# EAGLE schematic Adafruit NeoTrellis M4 (EAGLE 9.1.3)

## Sheet 1 of 2
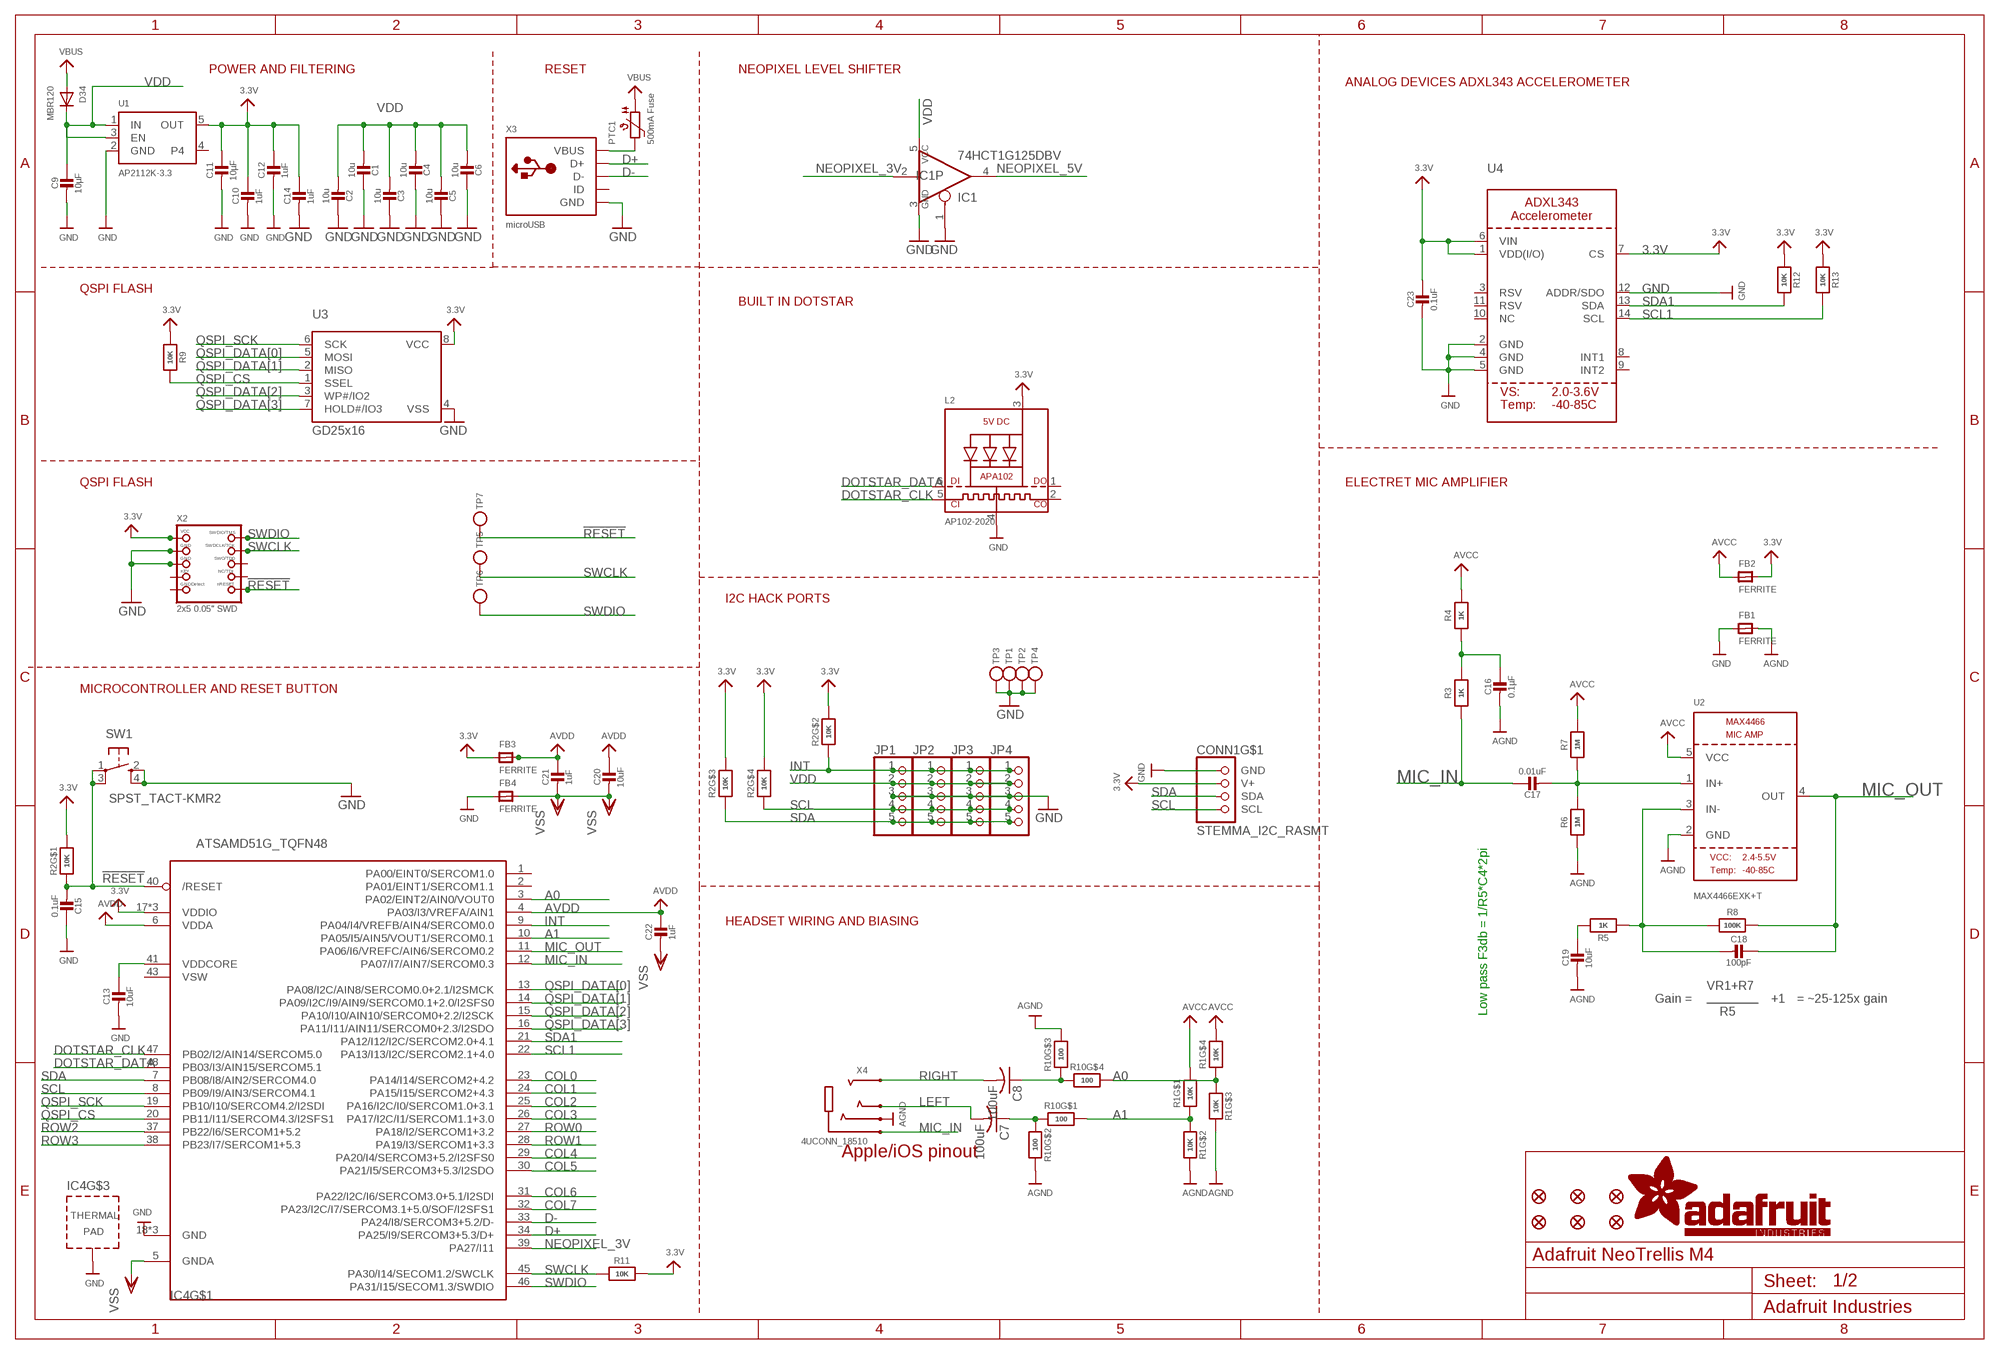
[diagram p0: schematic, sheet 1]

### Parts
C1  10u  CAP_CERAMIC0805-NOOUTLINE  [0805-NO]
C2  10u  CAP_CERAMIC0805-NOOUTLINE  [0805-NO]
C3  10u  CAP_CERAMIC0805-NOOUTLINE  [0805-NO]
C4  10u  CAP_CERAMIC0805-NOOUTLINE  [0805-NO]
C5  10u  CAP_CERAMIC0805-NOOUTLINE  [0805-NO]
C6  10u  CAP_CERAMIC0805-NOOUTLINE  [0805-NO]
C7  100uF  C-USC1210  [C1210]
C8  100uF  C-USC1210  [C1210]
C9  10µF  CAP_CERAMIC0805-NOOUTLINE  [0805-NO]
C10  1uF  CAP_CERAMIC0603_NO  [0603-NO]
C11  10µF  CAP_CERAMIC0805-NOOUTLINE  [0805-NO]
C12  1uF  CAP_CERAMIC0603_NO  [0603-NO]
C13  10uF  CAP_CERAMIC0805-NOOUTLINE  [0805-NO]
C14  1uF  CAP_CERAMIC0603_NO  [0603-NO]
C15  0.1uF  CAP_CERAMIC0603_NO  [0603-NO]
C16  0.1µF  CAP_CERAMIC0603_NO  [0603-NO]
C17  0.01uF  CAP_CERAMIC0603_NO  [0603-NO]
C18  100pF  CAP_CERAMIC0603_NO  [0603-NO]
C19  10uF  CAP_CERAMIC0805-NOOUTLINE  [0805-NO]
C20  10uF  CAP_CERAMIC0805-NOOUTLINE  [0805-NO]
C21  1uF  CAP_CERAMIC0603_NO  [0603-NO]
C22  1uF  CAP_CERAMIC0603_NO  [0603-NO]
C23  0.1uF  CAP_CERAMIC0603_NO  [0603-NO]
CONN1  STEMMA_I2C_RASMT  [JSTPH4]
D34  MBR120  DIODE_SOD-123FL  [SOD-123FL]
FB1  FERRITE  FERRITE0805  [0805]
FB2  FERRITE  FERRITE0805  [0805]
FB3  FERRITE  FERRITE-0805NO  [0805-NO]
FB4  FERRITE  FERRITE-0805NO  [0805-NO]
FID1  FIDUCIAL_1MM  [FIDUCIAL_1MM]
FID2  FIDUCIAL_1MM  [FIDUCIAL_1MM]
FID3  FIDUCIAL_1MM  [FIDUCIAL_1MM]
FID4  FIDUCIAL_1MM  [FIDUCIAL_1MM]
FID5  FIDUCIAL_1MM  [FIDUCIAL_1MM]
FID6  FIDUCIAL_1MM  [FIDUCIAL_1MM]
IC1  74HCT1G125DBV  74AHC1G125DBV  [SOT23-5]
IC4  ATSAMD51G_TQFN48  [TQFN48_7MM]
JP1  HEADER-1X5EDGESMT  [5P_EDGECONNECT]
JP2  HEADER-1X5EDGESMT  [5P_EDGECONNECT]
JP3  HEADER-1X5EDGESMT  [5P_EDGECONNECT]
JP4  HEADER-1X5EDGESMT  [5P_EDGECONNECT]
L2  AP102-2020  APA1022020  [APA102_2020]
PTC1  500mA Fuse  PTC1206  [1206]
R1  10K  RESISTOR_4PACK  [RESPACK_4X0603]
R2  10K  RESISTOR_4PACK  [RESPACK_4X0603]
R3  1K  RESISTOR_0603_NOOUT  [0603-NO]
R4  1K  RESISTOR_0603_NOOUT  [0603-NO]
R5  1K  RESISTOR_0603_NOOUT  [0603-NO]
R6  1M  RESISTOR_0603_NOOUT  [0603-NO]
R7  1M  RESISTOR_0603_NOOUT  [0603-NO]
R8  100K  RESISTOR_0603_NOOUT  [0603-NO]
R9  10K  RESISTOR_0603_NOOUT  [0603-NO]
R10  100  RESISTOR_4PACK  [RESPACK_4X0603]
R11  10K  RESISTOR_0603_NOOUT  [0603-NO]
R12  10K  RESISTOR_0603_NOOUT  [0603-NO]
R13  10K  RESISTOR_0603_NOOUT  [0603-NO]
SW1  SPST_TACT-KMR2  [KMR2]
TP1  TESTPOINT  [TESTPOINT_SMT]
TP2  TESTPOINT  [TESTPOINT_SMT]
TP3  TESTPOINT  [TESTPOINT_SMT]
TP4  TESTPOINT  [TESTPOINT_SMT]
TP5  TESTPOINTROUND2MM  [TESTPOINT_ROUND_2MM]
TP6  TESTPOINTROUND2MM  [TESTPOINT_ROUND_2MM]
TP7  TESTPOINTROUND1.5MM  [TESTPOINT_ROUND_1.5MM]
U1  AP2112K-3.3  VREG_SOT23-5  [SOT23-5]
U2  MAX4466EXK+T  AUDIOAMP_MAX4466  [SC70-5]
U3  GD25x16  SPIFLASH_8PIN208MIL  [SOIC8_208MIL]
U4  ACCEL_ADXL343  [LGA14]
X2  2x5 0.05" SWD  JTAG-CORTEXBOXPOSTS  [2X05_1.27MM_BOX_POSTS]
X3  microUSB  USB_MICRO_NARROW  [4UCONN_20329_NARROW]
X4  4UCONN_18510  AUDIO_3.5MMJACK_4POL  [4UCONN_18510]

### Nets
3.3V: C10.1 C11.1 C12.1 C14.1 C23.1 CONN1.2(V+) FB2.2 FB3.1 IC4.17(VDDIO) IC4.36(VDDIO) IC4.44(VDDIO) L2.3(VDD) R2.5 R2.6 R2.7 R2.8 R9.1 R11.2 R12.1 R13.1 U1.5(OUT) U3.8(VCC) U4.1(VDD(I/O)) U4.6(VIN) U4.7(CS) X2.1(VCC)
!RESET: C15.2 IC4.40(/RESET) R2.1 SW1.1(P) SW1.3(P1) TP7.P$1 X2.10(NRESET)
A0: IC4.3(PA02/EINT2/AIN0/VOUT0) R1.3 R1.4 R10.5
A1: IC4.10(PA05/I5/AIN5/VOUT1/SERCOM0.1) R1.1 R1.2 R10.8
AGND: C16.2 C19.2 FB1.2 R1.6 R1.7 R6.1 R10.6 R10.7 U2.2(GND) X4.4-INNER_SLEEVE(RING1)
AVCC: FB2.1 R1.5 R1.8 R4.2 R7.2 U2.5(VCC)
AVDD: C20.1 C21.1 C22.1 FB3.2 IC4.4(PA03/I3/VREFA/AIN1) IC4.6(VDDA)
COL0: IC4.23(PA14/I14/SERCOM2+4.2) ; also sheet 2
COL1: IC4.24(PA15/I15/SERCOM2+4.3) ; also sheet 2
COL2: IC4.25(PA16/I2C/I0/SERCOM1.0+3.1) ; also sheet 2
COL3: IC4.26(PA17/I2C/I1/SERCOM1.1+3.0) ; also sheet 2
COL4: IC4.29(PA20/I4/SERCOM3+5.2/I2SFS0) ; also sheet 2
COL5: IC4.30(PA21/I5/SERCOM3+5.3/I2SDO) ; also sheet 2
COL6: IC4.31(PA22/I2C/I6/SERCOM3.0+5.1/I2SDI) ; also sheet 2
COL7: IC4.32(PA23/I2C/I7/SERCOM3.1+5.0/SOF/I2SFS1) ; also sheet 2
D+: IC4.34(PA25/I9/SERCOM3+5.3/D+) X3.D+
D-: IC4.33(PA24/I8/SERCOM3+5.2/D-) X3.D-
DOTSTAR_CLK: IC4.47(PB02/I2/AIN14/SERCOM5.0) L2.5(CKI)
DOTSTAR_DATA: IC4.48(PB03/I3/AIN15/SERCOM5.1) L2.6(DI)
GND: C1.1 C2.1 C3.1 C4.1 C5.1 C6.1 C9.2 C10.2 C11.2 C12.2 C13.2 C14.2 C15.1 C23.2 CONN1.1(GND) FB1.1 FB4.1 IC1.1(OE) IC1.3(GND) IC4.18(GND) IC4.35(GND) IC4.42(GND) IC4.THERMAL(TP) JP1.3 JP2.3 JP3.3 JP4.3 L2.4(GND) SW1.2(S) SW1.4(S1) TP1.P$1 TP2.P$1 TP3.P$1 TP4.P$1 U1.2(GND) U3.4(VSS) U4.2(GND) U4.4(GND) U4.5(GND) U4.12(ADDR/SDO) X2.3(GND) X2.5(GND) X3.BASE@1(GND) X3.BASE@2(GND) X3.GND X3.SPRT@1(GND) X3.SPRT@2(GND) X3.SPRT@3(GND) X3.SPRT@4(GND) ; also sheet 2
INT: IC4.9(PA04/I4/VREFB/AIN4/SERCOM0.0) JP1.1 JP2.1 JP3.1 JP4.1 R2.2
LEFT: C7.2 X4.2-TIP(RING3)
MIC_IN: C17.1 IC4.12(PA07/I7/AIN7/SERCOM0.3) R3.1 X4.1-GND(TIP)
MIC_OUT: C18.1 IC4.11(PA06/I6/VREFC/AIN6/SERCOM0.2) R8.2 U2.4(OUT)
N$1: C8.1 R10.3 R10.4
N$65: C16.1 R3.2 R4.1
N$66: PTC1.2 X3.VBUS
N$67: C17.2 R6.2 R7.1 U2.1(IN+)
N$68: C18.2 R5.1 R8.1 U2.3(IN-)
N$69: C19.1 R5.2
N$70: C7.1 R10.1 R10.2
NEOPIXEL_3V: IC1.2(I) IC4.39(PA27/I11)
NEOPIXEL_5V: IC1.4(O) ; also sheet 2
QSPI_CS: IC4.20(PB11/I11/SERCOM4.3/I2SFS1) R9.2 U3.1(SSEL)
QSPI_DATA[0]: IC4.13(PA08/I2C/AIN8/SERCOM0.0+2.1/I2SMCK) U3.5(MOSI)
QSPI_DATA[1]: IC4.14(PA09/I2C/I9/AIN9/SERCOM0.1+2.0/I2SFS0) U3.2(MISO)
QSPI_DATA[2]: IC4.15(PA10/I10/AIN10/SERCOM0+2.2/I2SCK) U3.3(WP#/IO2)
QSPI_DATA[3]: IC4.16(PA11/I11/AIN11/SERCOM0+2.3/I2SDO) U3.7(HOLD#/IO3)
QSPI_SCK: IC4.19(PB10/I10/SERCOM4.2/I2SDI) U3.6(SCK)
RIGHT: C8.2 X4.3-OUTER_SLEEVE(RING2)
ROW0: IC4.27(PA18/I2/SERCOM1+3.2) ; also sheet 2
ROW1: IC4.28(PA19/I3/SERCOM1+3.3) ; also sheet 2
ROW2: IC4.37(PB22/I6/SERCOM1+5.2) ; also sheet 2
ROW3: IC4.38(PB23/I7/SERCOM1+5.3) ; also sheet 2
SCL: CONN1.4(SCL) IC4.8(PB09/I9/AIN3/SERCOM4.1) JP1.4 JP2.4 JP3.4 JP4.4 R2.4
SCL1: IC4.22(PA13/I13/I2C/SERCOM2.1+4.0) R13.2 U4.14(SCL)
SDA: CONN1.3(SDA) IC4.7(PB08/I8/AIN2/SERCOM4.0) JP1.5 JP2.5 JP3.5 JP4.5 R2.3
SDA1: IC4.21(PA12/I12/I2C/SERCOM2.0+4.1) R12.2 U4.13(SDA)
SWCLK: IC4.45(PA30/I14/SECOM1.2/SWCLK) R11.1 TP5.P$1 X2.4(SWDCLK)
SWDIO: IC4.46(PA31/I15/SECOM1.3/SWDIO) TP6.P$1 X2.2(SWDIO)
VBUS: D34.A PTC1.1
VDD [power]: C1.2 C2.2 C3.2 C4.2 C5.2 C6.2 C9.1 D34.C IC1.5(VCC) JP1.2 JP2.2 JP3.2 JP4.2 U1.1(IN) U1.3(EN) ; also sheet 2
VDDCORE: C13.1 IC4.41(VDDCORE)
VSS: C20.2 C21.2 C22.2 FB4.2 IC4.5(GNDA)
Unconnected: CONN1.NC1(MT) CONN1.NC2(MT) IC4.1(PA00/EINT0/SERCOM1.0) IC4.2(PA01/EINT1/SERCOM1.1) L2.1(DO) L2.2(CKO) U1.4 U4.3(RSV) U4.8(INT1) U4.9(INT2) U4.10(NC) U4.11(RSV) X2.6(SWO) X2.7(KEY) X2.8(TDI) X2.9(GNDDETECT) X3.ID

### Notes on the sheet
- POWER AND FILTERING | RESET | NEOPIXEL LEVEL SHIFTER
- ANALOG DEVICES ADXL343 ACCELEROMETER
- QSPI FLASH
- BUILT IN DOTSTAR
- QSPI FLASH | ELECTRET MIC AMPLIFIER
- I2C HACK PORTS
- MICROCONTROLLER AND RESET BUTTON
- HEADSET WIRING AND BIASING
- VR1+R7
- Gain = | +1 | = ~25-125x gain
- Low pass F3db = 1/R5*C4*2pi | R5
- Apple/iOS pinout

## Sheet 2 of 2
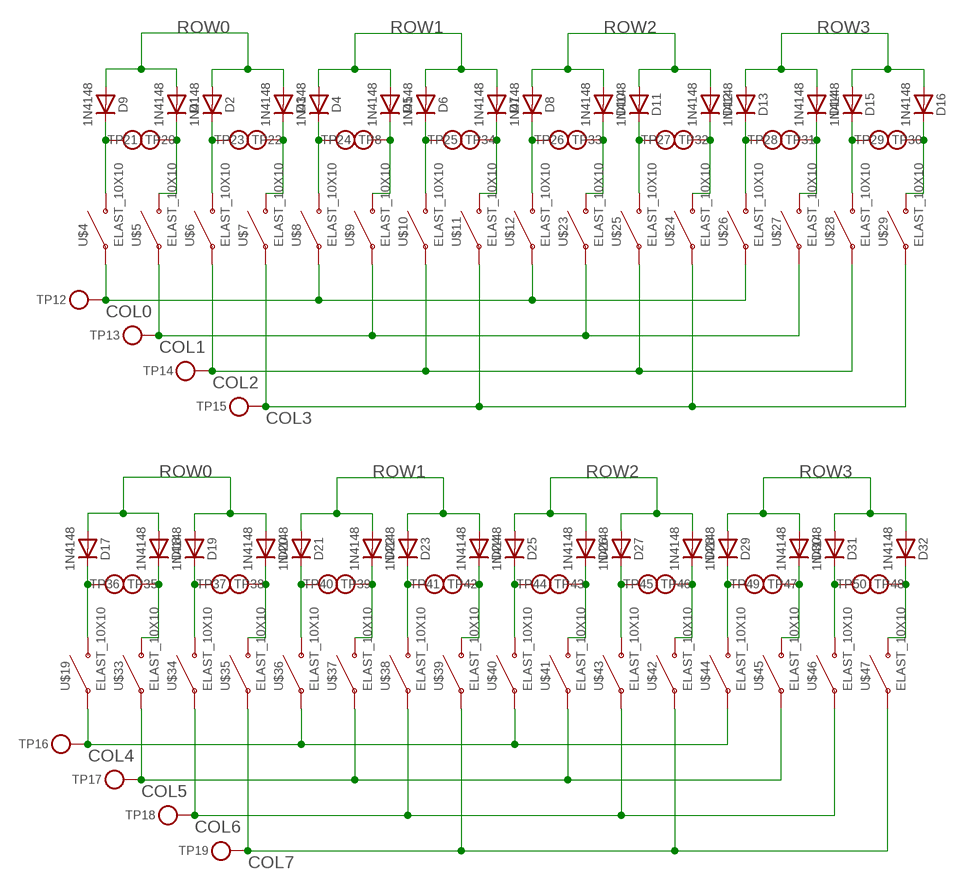
[diagram p1: schematic, sheet 2, part 1 of 2]
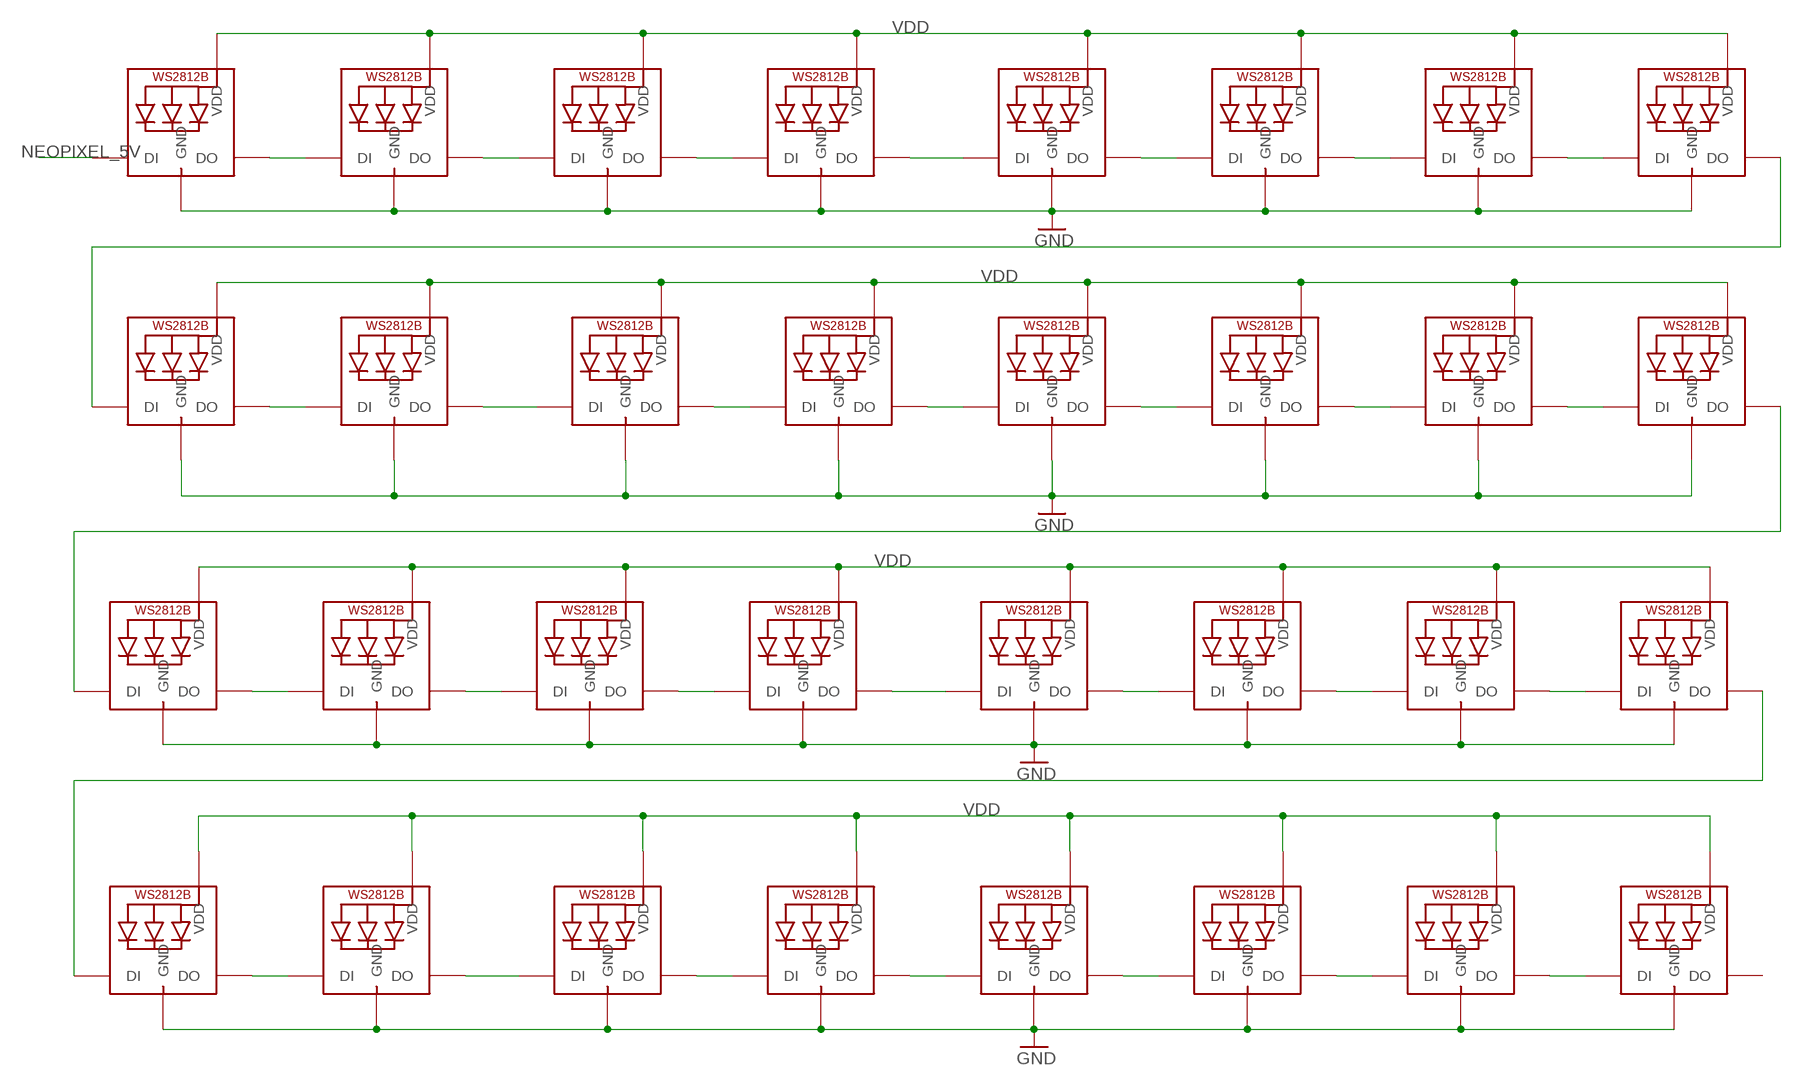
[diagram p2: schematic, sheet 2, part 2 of 2]

### Parts
D1  1N4148  DIODESOD-323  [SOD-323]
D2  1N4148  DIODESOD-323  [SOD-323]
D3  1N4148  DIODESOD-323  [SOD-323]
D4  1N4148  DIODESOD-323  [SOD-323]
D5  1N4148  DIODESOD-323  [SOD-323]
D6  1N4148  DIODESOD-323  [SOD-323]
D7  1N4148  DIODESOD-323  [SOD-323]
D8  1N4148  DIODESOD-323  [SOD-323]
D9  1N4148  DIODESOD-323  [SOD-323]
D10  1N4148  DIODESOD-323  [SOD-323]
D11  1N4148  DIODESOD-323  [SOD-323]
D12  1N4148  DIODESOD-323  [SOD-323]
D13  1N4148  DIODESOD-323  [SOD-323]
D14  1N4148  DIODESOD-323  [SOD-323]
D15  1N4148  DIODESOD-323  [SOD-323]
D16  1N4148  DIODESOD-323  [SOD-323]
D17  1N4148  DIODESOD-323  [SOD-323]
D18  1N4148  DIODESOD-323  [SOD-323]
D19  1N4148  DIODESOD-323  [SOD-323]
D20  1N4148  DIODESOD-323  [SOD-323]
D21  1N4148  DIODESOD-323  [SOD-323]
D22  1N4148  DIODESOD-323  [SOD-323]
D23  1N4148  DIODESOD-323  [SOD-323]
D24  1N4148  DIODESOD-323  [SOD-323]
D25  1N4148  DIODESOD-323  [SOD-323]
D26  1N4148  DIODESOD-323  [SOD-323]
D27  1N4148  DIODESOD-323  [SOD-323]
D28  1N4148  DIODESOD-323  [SOD-323]
D29  1N4148  DIODESOD-323  [SOD-323]
D30  1N4148  DIODESOD-323  [SOD-323]
D31  1N4148  DIODESOD-323  [SOD-323]
D32  1N4148  DIODESOD-323  [SOD-323]
LED1  WS2812B3535  [LED3535]
LED2  WS2812B3535  [LED3535]
LED3  WS2812B3535  [LED3535]
LED4  WS2812B3535  [LED3535]
LED5  WS2812B3535  [LED3535]
LED6  WS2812B3535  [LED3535]
LED7  WS2812B3535  [LED3535]
LED8  WS2812B3535  [LED3535]
LED9  WS2812B3535  [LED3535]
LED10  WS2812B3535  [LED3535]
LED11  WS2812B3535  [LED3535]
LED12  WS2812B3535  [LED3535]
LED13  WS2812B3535  [LED3535]
LED14  WS2812B3535  [LED3535]
LED15  WS2812B3535  [LED3535]
LED16  WS2812B3535  [LED3535]
LED17  WS2812B3535  [LED3535]
LED18  WS2812B3535  [LED3535]
LED19  WS2812B3535  [LED3535]
LED20  WS2812B3535  [LED3535]
LED21  WS2812B3535  [LED3535]
LED22  WS2812B3535  [LED3535]
LED23  WS2812B3535  [LED3535]
LED24  WS2812B3535  [LED3535]
LED25  WS2812B3535  [LED3535]
LED26  WS2812B3535  [LED3535]
LED27  WS2812B3535  [LED3535]
LED28  WS2812B3535  [LED3535]
LED29  WS2812B3535  [LED3535]
LED30  WS2812B3535  [LED3535]
LED31  WS2812B3535  [LED3535]
LED32  WS2812B3535  [LED3535]
TP8  TESTPOINTROUND1.5MM  [TESTPOINT_ROUND_1.5MM]
TP12  TESTPOINTROUND1.5MM  [TESTPOINT_ROUND_1.5MM]
TP13  TESTPOINTROUND1.5MM  [TESTPOINT_ROUND_1.5MM]
TP14  TESTPOINTROUND1.5MM  [TESTPOINT_ROUND_1.5MM]
TP15  TESTPOINTROUND1.5MM  [TESTPOINT_ROUND_1.5MM]
TP16  TESTPOINTROUND1.5MM  [TESTPOINT_ROUND_1.5MM]
TP17  TESTPOINTROUND1.5MM  [TESTPOINT_ROUND_1.5MM]
TP18  TESTPOINTROUND1.5MM  [TESTPOINT_ROUND_1.5MM]
TP19  TESTPOINTROUND1.5MM  [TESTPOINT_ROUND_1.5MM]
TP20  TESTPOINTROUND1.5MM  [TESTPOINT_ROUND_1.5MM]
TP21  TESTPOINTROUND1.5MM  [TESTPOINT_ROUND_1.5MM]
TP22  TESTPOINTROUND1.5MM  [TESTPOINT_ROUND_1.5MM]
TP23  TESTPOINTROUND1.5MM  [TESTPOINT_ROUND_1.5MM]
TP24  TESTPOINTROUND1.5MM  [TESTPOINT_ROUND_1.5MM]
TP25  TESTPOINTROUND1.5MM  [TESTPOINT_ROUND_1.5MM]
TP26  TESTPOINTROUND1.5MM  [TESTPOINT_ROUND_1.5MM]
TP27  TESTPOINTROUND1.5MM  [TESTPOINT_ROUND_1.5MM]
TP28  TESTPOINTROUND1.5MM  [TESTPOINT_ROUND_1.5MM]
TP29  TESTPOINTROUND1.5MM  [TESTPOINT_ROUND_1.5MM]
TP30  TESTPOINTROUND1.5MM  [TESTPOINT_ROUND_1.5MM]
TP31  TESTPOINTROUND1.5MM  [TESTPOINT_ROUND_1.5MM]
TP32  TESTPOINTROUND1.5MM  [TESTPOINT_ROUND_1.5MM]
TP33  TESTPOINTROUND1.5MM  [TESTPOINT_ROUND_1.5MM]
TP34  TESTPOINTROUND1.5MM  [TESTPOINT_ROUND_1.5MM]
TP35  TESTPOINTROUND1.5MM  [TESTPOINT_ROUND_1.5MM]
TP36  TESTPOINTROUND1.5MM  [TESTPOINT_ROUND_1.5MM]
TP37  TESTPOINTROUND1.5MM  [TESTPOINT_ROUND_1.5MM]
TP38  TESTPOINTROUND1.5MM  [TESTPOINT_ROUND_1.5MM]
TP39  TESTPOINTROUND1.5MM  [TESTPOINT_ROUND_1.5MM]
TP40  TESTPOINTROUND1.5MM  [TESTPOINT_ROUND_1.5MM]
TP41  TESTPOINTROUND1.5MM  [TESTPOINT_ROUND_1.5MM]
TP42  TESTPOINTROUND1.5MM  [TESTPOINT_ROUND_1.5MM]
TP43  TESTPOINTROUND1.5MM  [TESTPOINT_ROUND_1.5MM]
TP44  TESTPOINTROUND1.5MM  [TESTPOINT_ROUND_1.5MM]
TP45  TESTPOINTROUND1.5MM  [TESTPOINT_ROUND_1.5MM]
TP46  TESTPOINTROUND1.5MM  [TESTPOINT_ROUND_1.5MM]
TP47  TESTPOINTROUND1.5MM  [TESTPOINT_ROUND_1.5MM]
TP48  TESTPOINTROUND1.5MM  [TESTPOINT_ROUND_1.5MM]
TP49  TESTPOINTROUND1.5MM  [TESTPOINT_ROUND_1.5MM]
TP50  TESTPOINTROUND1.5MM  [TESTPOINT_ROUND_1.5MM]
U$4  ELAST_10X10  [ELAST_PAD_SQUARE_10MM_4X4WIDE]
U$5  ELAST_10X10  [ELAST_PAD_SQUARE_10MM_4X4WIDE]
U$6  ELAST_10X10  [ELAST_PAD_SQUARE_10MM_4X4WIDE]
U$7  ELAST_10X10  [ELAST_PAD_SQUARE_10MM_4X4WIDE]
U$8  ELAST_10X10  [ELAST_PAD_SQUARE_10MM_4X4WIDE]
U$9  ELAST_10X10  [ELAST_PAD_SQUARE_10MM_4X4WIDE]
U$10  ELAST_10X10  [ELAST_PAD_SQUARE_10MM_4X4WIDE]
U$11  ELAST_10X10  [ELAST_PAD_SQUARE_10MM_4X4WIDE]
U$12  ELAST_10X10  [ELAST_PAD_SQUARE_10MM_4X4WIDE]
U$19  ELAST_10X10  [ELAST_PAD_SQUARE_10MM_4X4WIDE]
U$23  ELAST_10X10  [ELAST_PAD_SQUARE_10MM_4X4WIDE]
U$24  ELAST_10X10  [ELAST_PAD_SQUARE_10MM_4X4WIDE]
U$25  ELAST_10X10  [ELAST_PAD_SQUARE_10MM_4X4WIDE]
U$26  ELAST_10X10  [ELAST_PAD_SQUARE_10MM_4X4WIDE]
U$27  ELAST_10X10  [ELAST_PAD_SQUARE_10MM_4X4WIDE]
U$28  ELAST_10X10  [ELAST_PAD_SQUARE_10MM_4X4WIDE]
U$29  ELAST_10X10  [ELAST_PAD_SQUARE_10MM_4X4WIDE]
U$33  ELAST_10X10  [ELAST_PAD_SQUARE_10MM_4X4WIDE]
U$34  ELAST_10X10  [ELAST_PAD_SQUARE_10MM_4X4WIDE]
U$35  ELAST_10X10  [ELAST_PAD_SQUARE_10MM_4X4WIDE]
U$36  ELAST_10X10  [ELAST_PAD_SQUARE_10MM_4X4WIDE]
U$37  ELAST_10X10  [ELAST_PAD_SQUARE_10MM_4X4WIDE]
U$38  ELAST_10X10  [ELAST_PAD_SQUARE_10MM_4X4WIDE]
U$39  ELAST_10X10  [ELAST_PAD_SQUARE_10MM_4X4WIDE]
U$40  ELAST_10X10  [ELAST_PAD_SQUARE_10MM_4X4WIDE]
U$41  ELAST_10X10  [ELAST_PAD_SQUARE_10MM_4X4WIDE]
U$42  ELAST_10X10  [ELAST_PAD_SQUARE_10MM_4X4WIDE]
U$43  ELAST_10X10  [ELAST_PAD_SQUARE_10MM_4X4WIDE]
U$44  ELAST_10X10  [ELAST_PAD_SQUARE_10MM_4X4WIDE]
U$45  ELAST_10X10  [ELAST_PAD_SQUARE_10MM_4X4WIDE]
U$46  ELAST_10X10  [ELAST_PAD_SQUARE_10MM_4X4WIDE]
U$47  ELAST_10X10  [ELAST_PAD_SQUARE_10MM_4X4WIDE]

### Nets
COL0: TP12.P$1 U$4.P$1 U$8.P$1 U$12.P$1 U$26.P$1 ; also sheet 1
COL1: TP13.P$1 U$5.P$1 U$9.P$1 U$23.P$1 U$27.P$1 ; also sheet 1
COL2: TP14.P$1 U$6.P$1 U$10.P$1 U$25.P$1 U$28.P$1 ; also sheet 1
COL3: TP15.P$1 U$7.P$1 U$11.P$1 U$24.P$1 U$29.P$1 ; also sheet 1
COL4: TP16.P$1 U$19.P$1 U$36.P$1 U$40.P$1 U$44.P$1 ; also sheet 1
COL5: TP17.P$1 U$33.P$1 U$37.P$1 U$41.P$1 U$45.P$1 ; also sheet 1
COL6: TP18.P$1 U$34.P$1 U$38.P$1 U$43.P$1 U$46.P$1 ; also sheet 1
COL7: TP19.P$1 U$35.P$1 U$39.P$1 U$42.P$1 U$47.P$1 ; also sheet 1
GND: LED1.4(GND) LED2.4(GND) LED3.4(GND) LED4.4(GND) LED5.4(GND) LED6.4(GND) LED7.4(GND) LED8.4(GND) LED9.4(GND) LED10.4(GND) LED11.4(GND) LED12.4(GND) LED13.4(GND) LED14.4(GND) LED15.4(GND) LED16.4(GND) LED17.4(GND) LED18.4(GND) LED19.4(GND) LED20.4(GND) LED21.4(GND) LED22.4(GND) LED23.4(GND) LED24.4(GND) LED25.4(GND) LED26.4(GND) LED27.4(GND) LED28.4(GND) LED29.4(GND) LED30.4(GND) LED31.4(GND) LED32.4(GND) ; also sheet 1
N$2: D9.C TP20.P$1 U$4.P$2
N$3: D1.C TP21.P$1 U$5.P$2
N$4: D2.C TP22.P$1 U$6.P$2
N$5: D3.C TP23.P$1 U$7.P$2
N$6: D4.C TP8.P$1 U$8.P$2
N$7: LED17.3(DO) LED18.1(DI)
N$8: LED18.3(DO) LED19.1(DI)
N$9: D5.C TP24.P$1 U$9.P$2
N$10: LED19.3(DO) LED20.1(DI)
N$11: LED1.3(DO) LED2.1(DI)
N$12: LED2.3(DO) LED3.1(DI)
N$13: LED3.3(DO) LED4.1(DI)
N$14: LED4.3(DO) LED5.1(DI)
N$15: D6.C TP34.P$1 U$10.P$2
N$16: LED5.3(DO) LED6.1(DI)
N$17: LED6.3(DO) LED7.1(DI)
N$18: D7.C TP25.P$1 U$11.P$2
N$19: LED7.3(DO) LED8.1(DI)
N$20: D8.C TP33.P$1 U$12.P$2
N$21: LED8.3(DO) LED9.1(DI)
N$22: D10.C TP26.P$1 U$23.P$2
N$23: D11.C TP32.P$1 U$25.P$2
N$24: D12.C TP27.P$1 U$24.P$2
N$25: D13.C TP31.P$1 U$26.P$2
N$26: D14.C TP28.P$1 U$27.P$2
N$27: D15.C TP30.P$1 U$28.P$2
N$28: D16.C TP29.P$1 U$29.P$2
N$29: LED9.3(DO) LED10.1(DI)
N$30: LED10.3(DO) LED12.1(DI)
N$31: LED11.1(DI) LED12.3(DO)
N$32: LED11.3(DO) LED13.1(DI)
N$33: LED13.3(DO) LED14.1(DI)
N$34: LED14.3(DO) LED15.1(DI)
N$35: LED15.3(DO) LED16.1(DI)
N$36: LED20.3(DO) LED21.1(DI)
N$37: LED21.3(DO) LED22.1(DI)
N$38: LED22.3(DO) LED23.1(DI)
N$39: LED23.3(DO) LED24.1(DI)
N$40: LED24.3(DO) LED25.1(DI)
N$41: LED25.3(DO) LED26.1(DI)
N$42: LED26.3(DO) LED28.1(DI)
N$43: LED27.1(DI) LED28.3(DO)
N$44: LED27.3(DO) LED29.1(DI)
N$45: LED29.3(DO) LED30.1(DI)
N$46: LED30.3(DO) LED31.1(DI)
N$47: LED31.3(DO) LED32.1(DI)
N$48: D17.C TP35.P$1 U$19.P$2
N$49: D18.C TP36.P$1 U$33.P$2
N$50: D19.C TP38.P$1 U$34.P$2
N$51: D20.C TP37.P$1 U$35.P$2
N$52: D21.C TP39.P$1 U$36.P$2
N$53: D22.C TP40.P$1 U$37.P$2
N$54: D23.C TP42.P$1 U$38.P$2
N$55: D24.C TP41.P$1 U$39.P$2
N$56: D25.C TP43.P$1 U$40.P$2
N$57: D26.C TP44.P$1 U$41.P$2
N$58: D27.C TP46.P$1 U$43.P$2
N$59: D28.C TP45.P$1 U$42.P$2
N$60: D29.C TP47.P$1 U$44.P$2
N$61: D30.C TP49.P$1 U$45.P$2
N$62: D31.C TP48.P$1 U$46.P$2
N$63: D32.C TP50.P$1 U$47.P$2
N$64: LED16.3(DO) LED17.1(DI)
NEOPIXEL_5V: LED1.1(DI) ; also sheet 1
ROW0: D1.A D2.A D3.A D9.A D17.A D18.A D19.A D20.A ; also sheet 1
ROW1: D4.A D5.A D6.A D7.A D21.A D22.A D23.A D24.A ; also sheet 1
ROW2: D8.A D10.A D11.A D12.A D25.A D26.A D27.A D28.A ; also sheet 1
ROW3: D13.A D14.A D15.A D16.A D29.A D30.A D31.A D32.A ; also sheet 1
VDD [power]: LED1.2(VDD) LED2.2(VDD) LED3.2(VDD) LED4.2(VDD) LED5.2(VDD) LED6.2(VDD) LED7.2(VDD) LED8.2(VDD) LED9.2(VDD) LED10.2(VDD) LED11.2(VDD) LED12.2(VDD) LED13.2(VDD) LED14.2(VDD) LED15.2(VDD) LED16.2(VDD) LED17.2(VDD) LED18.2(VDD) LED19.2(VDD) LED20.2(VDD) LED21.2(VDD) LED22.2(VDD) LED23.2(VDD) LED24.2(VDD) LED25.2(VDD) LED26.2(VDD) LED27.2(VDD) LED28.2(VDD) LED29.2(VDD) LED30.2(VDD) LED31.2(VDD) LED32.2(VDD) ; also sheet 1
Unconnected: LED32.3(DO)

## Power pins joined to a net without a drawn wire
VSW: IC4.43(VSW)

## Library data of the parts
C1-C6 C9-C23 = microbuilder:CAP_CERAMIC: Ceramic Capacitors For new designs, use the packages preceded by an '_' character since they are more reliable: The following footprints should be used on most boards: _0402 - Standard footprint for regular board layouts _0603 - Standard footprint for regular board layouts _0805 - Standard footprint for regular board layouts _1206 - Standard footprint for regular board layouts For extremely tight-pitch boards where space is at a premium, the following 'micro-pitch' footprints can be used (smaller pads, no silkscreen outline, etc.): _0402MP - Micro-pitch footprint for very dense/compact boards _0603MP - Micro-pitch footprint for very dense/compact boards _0805MP - Micro-pitch footprint for very dense/compact boards _1206MP - Micro-pitch footprint for very dense/compact boards
C7 C8 = resistor:C-US: CAPACITOR, American symbol
CONN1 = microbuilder:STEMMA_I2C
D1-D32 = microbuilder:DIODE: Diode
D34 = adafruit:DIODE: Diode
FB1-FB4 = microbuilder:FERRITE: Ferrite Bead 0603 MMZ1608B121C - 120 Ohm @ 100MHz, 600mA, 0.15 Ohm DC Resistance - Digikey: 445-2164-1-ND BK1608HW121-T - 120 Ohm, 600mA Ferrite Chip - Digikey: 587-1876-2-ND 0805 HZ0805B272R-10 - 2.7K Ohm @ 100MHz, 200mA, 0.8 Ohm DC Resistance - Digikey: 240-2504-1-ND (see also Murata BLM21BD272SN1L) MMZ2012Y152B - 1.5K Ohm @ 100MHz, 500mA, 0.4 Ohm DC Resistance - Digikey: 445-1560-1-ND - Mainly for high frequency (80-400MHz) MMZ2012R102A - 1K Ohm @ 100MHz, 500mA, 0.3 Ohm DC Resistance - Digikey: 445-1555-2-ND - More general purpose (10-200MHz)
FID1-FID6 = microbuilder:FIDUCIAL: Fiducial Alignment Points Various fiducial points for machine vision alignment.; BOM: EXCLUDE
IC1 = 74xx-little-us:74*1G125: Single Bus Buffer Gate with 3-State Output
IC4 = microbuilder:ATSAMD51G
JP1-JP4 = microbuilder:HEADER-1X5: PIN HEADER
L2 = microbuilder:APA102: APA102/DotStar Pixels VCC: 5V DC Refresh Rate: 400Hz
LED1-LED32 = microbuilder:WS2812B
PTC1 = microbuilder:PTC: PTC (Resettable Fuse) 1206 Package 250mA PTC (16V Max, Time-to-Trip: 0.08s) - Digikey: F2110CT-ND 1210 Package 100mA PTC (30V Max, Time-to-Trip: 0.6s) - Digikey: MF-USMF010-2CT-ND 1812 Package 750mA PTC (24V Max, Time-to-Trip: 0.2s) - Digikey: MF-MSMF075/24-2CT-ND
R1 R2 R10 = microbuilder:RESISTOR_4PACK: Resistor Packs (4 resistors) 4 x 0603 10K 1/16W - Digikey: YC164J-10KCT-ND
R3-R9 R11-R13 = microbuilder:RESISTOR: Resistors For new designs, use the packages preceded by an '_' character since they are more reliable: The following footprints should be used on most boards: _0402 - Standard footprint for regular board layouts _0603 - Standard footprint for regular board layouts _0805 - Standard footprint for regular board layouts _1206 - Standard footprint for regular board layouts For extremely tight-pitch boards where space is at a premium, the following 'micro-pitch' footprints can be used (smaller pads, no silkscreen outline, etc.): _0402MP - Micro-pitch footprint for very dense/compact boards _0603MP - Micro-pitch footprint for very dense/compact boards _0805MP - Micro-pitch footprint for very dense/compact boards _1206MP - Micro-pitch footprint for very dense/compact boards
SW1 = adafruit:SPST_TACT: SMT 6mm switch, EVQQ2 series http://www.ladyada.net/library/eagle
TP1-TP8 TP12-TP50 = microbuilder:TESTPOINT: Test Point Various test points for characterisation and PCB testing TESTPOINT_SMT - Compact Surface Mount Test Point [Digikey: 5016KTR-ND]
U1 = microbuilder:VREG_SOT23-5: SOT23-5 Fixed Voltage Regulators Part Current Out V Out V In V Dropout θJA (°C/W) TJ (°C) Digikey Part No. ADP121 150mA 3.3V 3.4-5.5V 0.09V @ 150mA -- -- ADP121-AUJZ33R7CT-ND ADP121 150mA 3.0V 3.1-5.5V 0.09V @ 150mA -- -- ADP121-AUJZ30R7CT-ND ADP122 300mA 3.3V 3.4-5.5V 0.085V @ 300mA -- -- ADP122AUJZ-3.3-R7CT-ND ADP1712 300mA 3.3V 3.5-5.5V 0.17V @ 300mA -- -- ADP1712AUJZ-3.3-R7TR-ND AP7311 (Low Cost) 150mA 3.3V 3.5-6V 0.15V @ 150mA -- -- AP7311-33WG-7DICT-ND LD39015M18R 150mA 1.8V 1.9V-5.5V 0.08V @ 100mA -- -- 497-6977-1-ND LP2985A-33DBVR 150mA 3.3V 3.3-16V 0.28V @ 150mA 206 150 296-18479-1-ND MCP1824T-3302E/OT 300mA 3.3V 3.5V-6V 0.2V @ 300mA -- -- MCP1824T-3302E/OTCT-ND MIC5205-2.5YM5 TR 150mA 2.5V 2.7-16V 0.165V @ 150mA -- -- 576-1257-2-ND MIC5205-3.0YM5 TR 150mA 3.0V 3.2V-16V 0.165V @ 150mA -- -- 576-1258-2-ND MIC5205-3.3YM5 TR 150mA 3.3V 3.5V-16V 0.165V @ 150mA -- -- 576-1259-2-ND TPS780330220 150mA 3.3V+2.2V 3.6-5.5V 250mV Max -- -- 296-23332-1-ND TDA3663/N1,135 100mA 3.3V 3.5-45V 0.18V @ 50mA -- -- 568-5343-1-ND Max operating temp can be calculated using θJA, TJ (max junction temperature), and power in watts. Set the "Maximum Ambient Temperature" until it reaches TJ ("Max Junction Temperature"), which is the absolute limit for safe use of the regulator: Heat Sink Temperature Calculator <http://www.daycounter.com/Calculators/Heat-Sink-Temperature-Calculator.phtml> For example, With 12V source into a 3.3V LP2985 and a 30mA load, we are dissipating (12V-3.3V) * 0.03A = 0.261W. With a θJA of 206 °C/W, a TJ of 150°C, and 261mW we can safely use the chip without a heat sink up to 75°C (=147.1°C Junction Temperature).
U2 = microbuilder:AUDIOAMP_MAX4466: MAX4466 - Microphone Pre-Amp
U3 = microbuilder:SPIFLASH_8PIN: SOIC8 SPI Flash Be careful with the size since SOIC8 flash comes in several 'widths' SOIC8 150 mil M25P16 - 16Mbit (2Mbit x 8) Serial Flash (75MHz SPI Bus), Supply: 2.7-3.6V Digikey: SOIC8 - M25P16-VMN6P-ND SOIC8 208 mil W25Q16BVSSIG - 16Mbit (2Mbit x 8) Serial Flash (104MHz SPI Bus), Supply: 2.7-3.6V Digikey: SOIC8 - W25Q16BVSSIG-ND
U4 = microbuilder:ACCEL_ADXL343: ADXL343 - Digital Accelerometer 2/4/8/16g
U$4-U$12 U$19 U$23-U$29 U$33-U$47 = microbuilder:ELAST_10X10: 10mm x 10mm elastomer pad
X2 = microbuilder:JTAG-CORTEX: Serial Wire (SW-DP) Connector Standard 0.05" 10-pin connector is for use with the Cortex M and Cortex A SWD (serial wire debugger) interface (SW-DP) Connectors 2x05_1.27MM_SMT - Inexpensive surface-mount header with bare pins, compatible with standard 10-pin SWD cables (4UCON: 16846) 2x05_1.27MM_BOX_NOPOSTS - Polarised surface-mount box (4UCON with caps: 19735, without caps: 15117 2x05_1.27MM_BOX_POSTS - Polarised surface-mount box with mounting holes (4UCON: 20317) Pinout: http://infocenter.arm.com/help/topic/com.arm.doc.faqs/attached/13634/cortex_debug_connectors.pdf http://www.keil.com/peripherals/coresight/connectors.asp
X3 = microbuilder:USB: USB Connectors USBMINIB - Surface Mount Female Mini-B USB Connector 4UConnector: 06564
X4 = microbuilder:AUDIO_3.5MMJACK_4POL: Footprint courtesy Morten Hjerde (Riftlabs.com) These are normally connected as follows (4-pin 3.5mm 'TRRS'), from left-to right on the schematic symbol above: Tip: Left Audio Outermost Ring: Right Audio Innermost Ring: Common/GND Shell: Mic+

## Net classes
1 power: width 0.406 mm